# EAGLE schematic Power Supply Schematic v5 (EAGLE 9.7.0)
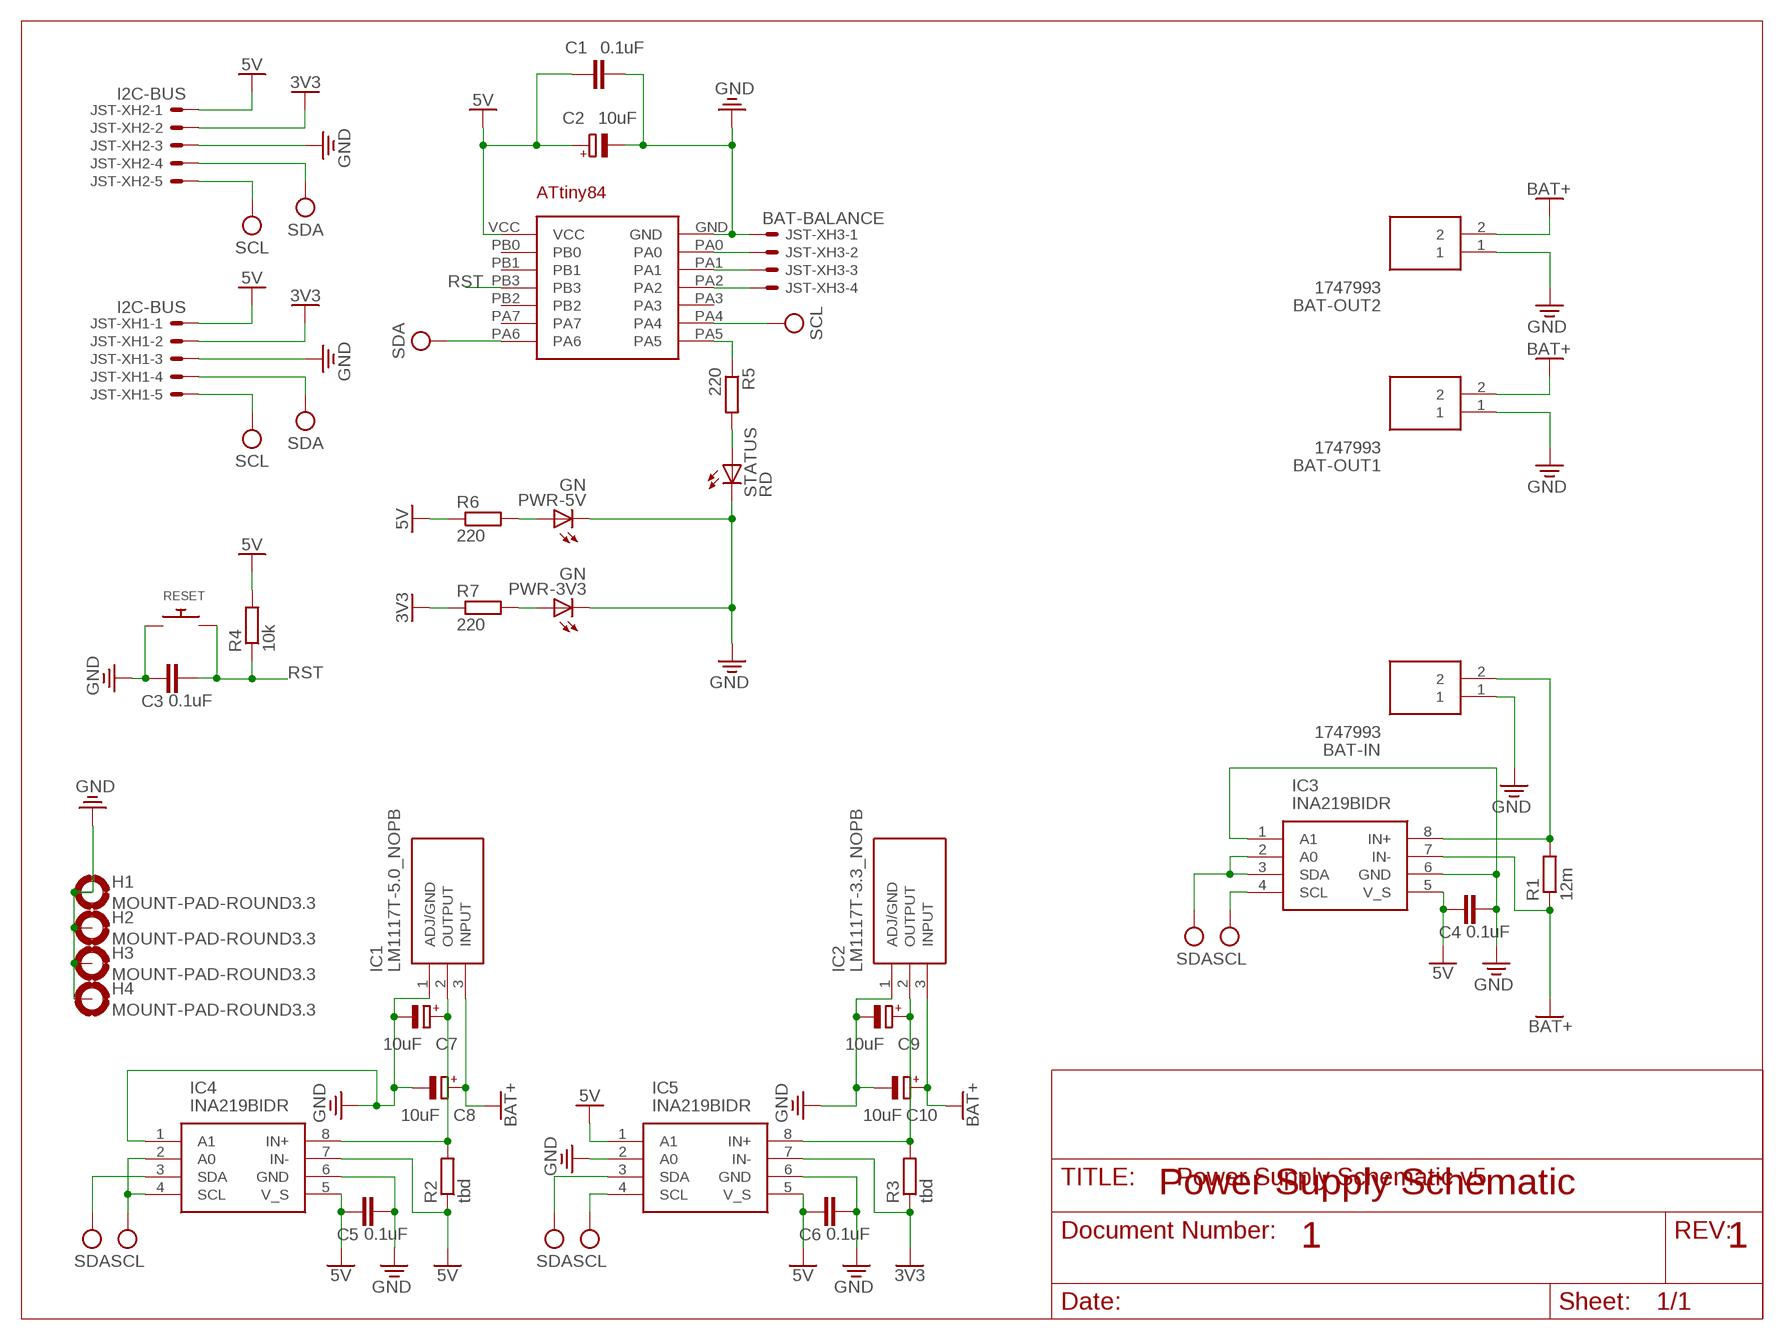
[diagram p0: schematic, sheet 1]

## Parts
BAT-IN  1747993  [1747993]
BAT-OUT1  1747993  [1747993]
BAT-OUT2  1747993  [1747993]
C1  0.1uF  C-EU025-025X050  [C025-025X050]
C2  10uF  CPOL-EUE5-10.5  [E5-10,5]
C3  0.1uF  C-EU025-030X050  [C025-030X050]
C4  0.1uF  C-EU025-030X050  [C025-030X050]
C5  0.1uF  C-EU025-030X050  [C025-030X050]
C6  0.1uF  C-EU025-030X050  [C025-030X050]
C7  10uF  CPOL-EUE5-10.5  [E5-10,5]
C8  10uF  CPOL-EUE5-10.5  [E5-10,5]
C9  10uF  CPOL-EUE5-10.5  [E5-10,5]
C10  10uF  CPOL-EUE5-10.5  [E5-10,5]
H1  MOUNT-PAD-ROUND3.3  [3,3-PAD]
H2  MOUNT-PAD-ROUND3.3  [3,3-PAD]
H3  MOUNT-PAD-ROUND3.3  [3,3-PAD]
H4  MOUNT-PAD-ROUND3.3  [3,3-PAD]
IC1  LM1117T-5.0_NOPB  [TO254P470X1028X1955-3P]
IC2  LM1117T-3.3_NOPB  [TO254P470X1028X1955-3P]
IC3  INA219BIDR  [SOIC127P600X175-8N]
IC4  INA219BIDR  [SOIC127P600X175-8N]
IC5  INA219BIDR  [SOIC127P600X175-8N]
JST-XH1  I2C-BUS  JST-XH-05-PIN-LONG-PAD  [JST-XH-05-PACKAGE-LONG-PAD]
JST-XH2  I2C-BUS  JST-XH-05-PIN-LONG-PAD  [JST-XH-05-PACKAGE-LONG-PAD]
JST-XH3  BAT-BALANCE  JST-XH-04-PIN-LONG-PAD  [JST-XH-04-PACKAGE-LONG-PAD]
PWR-3V3  GN  LED5MM  [LED5MM]
PWR-5V  GN  LED5MM  [LED5MM]
R1  12m  R-EU_0204/7  [0204/7]
R2  tbd  R-EU_0204/7  [0204/7]
R3  tbd  R-EU_0204/7  [0204/7]
R4  10k  R-EU_0204/7  [0204/7]
R5  220  R-EU_0204/7  [0204/7]
R6  220  R-EU_0204/7  [0204/7]
R7  220  R-EU_0204/7  [0204/7]
RESET  SWITCH_PUSHBUTTONEVQ-PE  [TACT_PANA-EVQ]
STATUS  RD  LED5MM  [LED5MM]
U$1  ATTINY84DIP  [ATTINY84(DIP)]

## Nets
3V3: IC5.7(IN-) JST-XH1.2 JST-XH2.2 R3.1 R7.1
5V: C1.1 C2.+ C4.1 C5.1 C6.1 IC3.5(V_S) IC4.5(V_S) IC4.7(IN-) IC5.1(A1) IC5.5(V_S) JST-XH1.1 JST-XH2.1 R2.1 R4.2 R6.1 U$1.VCC
BAT+: BAT-OUT1.2 BAT-OUT2.2 C8.+ C10.+ IC1.3(INPUT) IC2.3(INPUT) IC3.7(IN-) R1.1
GND: BAT-IN.1 BAT-OUT1.1 BAT-OUT2.1 C1.2 C2.- C3.1 C4.2 C5.2 C6.2 C7.- C8.- C9.- C10.- H1.B3,3(MOUNT) H2.B3,3(MOUNT) H3.B3,3(MOUNT) H4.B3,3(MOUNT) IC1.1(ADJ/GND) IC2.1(ADJ/GND) IC3.1(A1) IC3.6(GND) IC4.1(A1) IC4.6(GND) IC5.2(A0) IC5.6(GND) JST-XH1.3 JST-XH2.3 JST-XH3.1 PWR-3V3.K(C) PWR-5V.K(C) RESET.P$1 STATUS.K(C) U$1.GND
N$1: BAT-IN.2 IC3.8(IN+) R1.2
N$2: JST-XH3.2 U$1.PA0
N$3: JST-XH3.3 U$1.PA1
N$4: JST-XH3.4 U$1.PA2
N$5: C7.+ IC1.2(OUTPUT) IC4.8(IN+) R2.2
N$6: C9.+ IC2.2(OUTPUT) IC5.8(IN+) R3.2
N$7: R5.1 U$1.PA5
N$8: R5.2 STATUS.A
N$9: PWR-5V.A R6.2
N$10: PWR-3V3.A R7.2
RST: C3.2 R4.1 RESET.P$2 U$1.PB3
SCL: IC3.4(SCL) IC4.2(A0) IC4.4(SCL) IC5.4(SCL) JST-XH1.5 JST-XH2.5 U$1.PA4
SDA: IC3.2(A0) IC3.3(SDA) IC4.3(SDA) IC5.3(SDA) JST-XH1.4 JST-XH2.4 U$1.PA6
Unconnected: U$1.PA3 U$1.PA7 U$1.PB0 U$1.PB1 U$1.PB2

## Notes on the sheet
- Power Supply Schematic
- 1 | 1

## Library data of the parts
BAT-IN BAT-OUT1 BAT-OUT2 = SamacSys_Parts:1747993: PCB header, nominal cross section: 2.5 mm?, color: green, nominal current: 12 A, rated voltage (III/2): 320 V, contact surface: Gold, type of contact: Male connector, Number of potentials: 2, Number of rows: 1, Number of positions per row: 2, number of connections: 2, product range: MSTBVA 2,5/..-G, pitch: 5.08 mm, mounting: Wave soldering, pin layout: Linear pinning, solder pin [P]: 3.9 mm, Stecksystem: CLASSIC COMBICON, Locking: without, type of packaging: packed in cardboard Source: Datasheet <http://www.phoenixcontact.com/de/produkte/1747993/pdf>; DESCRIPTION: PCB header, nominal cross section: 2.5 mm?, color: green, nominal current: 12 A, rated voltage (III/2): 320 V, contact surface: Gold, type of contact: Male connector, Number of potentials: 2, Number of rows: 1, Number of positions per row: 2, number of connections: 2, product range: MSTBVA 2,5/..-G, pitch: 5.08 mm, mounting: Wave soldering, pin layout: Linear pinning, solder pin [P]: 3.9 mm, Stecksystem: CLASSIC COMBICON, Locking: without, type of packaging: packed in cardboard; HEIGHT: 12.15mm; MANUFACTURER_NAME: Phoenix Contact; MANUFACTURER_PART_NUMBER: 1747993; MOUSER_PART_NUMBER: 651-1747993; MOUSER_PRICE-STOCK: https://www.mouser.co.uk/ProductDetail/Phoenix-Contact/1747993?qs=cq3Rj917t3li0%2FrJTXaRgg%3D%3D
C1 C3-C6 = rcl:C-EU: CAPACITOR, European symbol; SPICEPREFIX: C
C2 C7-C10 = rcl:CPOL-EU: POLARIZED CAPACITOR, European symbol; SPICEPREFIX: C
H1-H4 = holes:MOUNT-PAD-ROUND: MOUNTING PAD, round
IC1 = SamacSys_Parts:LM1117T-5.0_NOPB: Space saving 800-mA low-dropout linear regulator with internal current limit Source: Datasheet <http://www.ti.com/lit/gpn/lm1117>; DESCRIPTION: Space saving 800-mA low-dropout linear regulator with internal current limit; HEIGHT: 4.7mm; MANUFACTURER_NAME: Texas Instruments; MANUFACTURER_PART_NUMBER: LM1117T-5.0/NOPB; MOUSER2_PART_NUMBER: 926-LM1117T-50/NOPB; MOUSER2_PRICE-STOCK: https://www.mouser.com/Search/Refine.aspx?Keyword=926-LM1117T-50%2FNOPB
IC2 = SamacSys_Parts:LM1117T-3.3_NOPB: 800mA,3.3V,LDO Voltage Reg.,LM1117T-3.3 Texas Instruments LM1117T-3.3/NOPB, LDO Voltage Regulator, 800mA, 3.3 V Source: Datasheet <http://www.ti.com/lit/ds/symlink/lm1117.pdf>; DESCRIPTION: 800mA,3.3V,LDO Voltage Reg.,LM1117T-3.3 Texas Instruments LM1117T-3.3/NOPB, LDO Voltage Regulator, 800mA, 3.3 V; HEIGHT: 4.7mm; MANUFACTURER_NAME: Texas Instruments; MANUFACTURER_PART_NUMBER: LM1117T-3.3/NOPB
IC3-IC5 = SamacSys_Parts:INA219BIDR: 26-V, Bidirectional, Zero-Drift, High-Side, I2C Out Current/Power Monitor Source: Datasheet <https://www.ti.com/lit/ds/symlink/ina219.pdf?HQS=TI-null-null-digikeymode-df-pf-null-wwe&ts=1601223553719>; DESCRIPTION: 26-V, Bidirectional, Zero-Drift, High-Side, I2C Out Current/Power Monitor; HEIGHT: 1.75mm; MANUFACTURER_NAME: Texas Instruments; MANUFACTURER_PART_NUMBER: INA219BIDR; MOUSER_PART_NUMBER: 595-INA219BIDR; MOUSER_PRICE-STOCK: https://www.mouser.co.uk/ProductDetail/Texas-Instruments/INA219BIDR?qs=1WmUhT%2FVMINyGsXNJcdD5Q%3D%3D
JST-XH1 JST-XH2 = Rembrandt Electronics - JST XH Connectors v1-0:JST-XH-05-PIN: JST XH Connector 2 Pin Wire to board connector. Pitch: 2,54 mm, (0.100") Number of pins: 5 Created by Rembrandt Electronics www.rembrandtelectronics.com
JST-XH3 = Rembrandt Electronics - JST XH Connectors v1-0:JST-XH-04-PIN: JST XH Connector 2 Pin Wire to board connector. Pitch: 2,54 mm, (0.100") Number of pins: 4 Created by Rembrandt Electronics www.rembrandtelectronics.com
PWR-3V3 PWR-5V STATUS = adafruit:LED: LED OSRAM: - CHIPLED LG R971, LG N971, LY N971, LG Q971, LY Q971, LO R971, LY R971 LH N974, LH R974 LS Q976, LO Q976, LY Q976 LO Q996 - Hyper CHIPLED LW Q18S LB Q993, LB Q99A, LB R99A - SideLED LS A670, LO A670, LY A670, LG A670, LP A670 LB A673, LV A673, LT A673, LW A673 LH A674 LY A675 LS A676, LA A676, LO A676, LY A676, LW A676 LS A679, LY A679, LG A679 - Hyper Micro SIDELED® LS Y876, LA Y876, LO Y876, LY Y876 LT Y87S - SmartLED LW L88C, LW L88S LB L89C, LB L89S, LG L890 LS L89K, LO L89K, LY L89K LS L896, LA L896, LO L896, LY L896 - TOPLED LS T670, LO T670, LY T670, LG T670, LP T670 LSG T670, LSP T670, LSY T670, LOP T670, LYG T670 LG T671, LOG T671, LSG T671 LB T673, LV T673, LT T673, LW T673 LH T674 LS T676, LA T676, LO T676, LY T676, LB T676, LH T676, LSB T676, LW T676 LB T67C, LV T67C, LT T67C, LS T67K, LO T67K, LY T67K, LW E67C LS E67B, LA E67B, LO E67B, LY E67B, LB E67C, LV E67C, LT E67C LW T67C LS T679, LY T679, LG T679 LS T770, LO T770, LY T770, LG T770, LP T770 LB T773, LV T773, LT T773, LW T773 LH T774 LS E675, LA E675, LY E675, LS T675 LS T776, LA T776, LO T776, LY T776, LB T776 LHGB T686 LT T68C, LB T68C - Hyper Mini TOPLED® LB M676 - Mini TOPLED Santana® LG M470 LS M47K, LO M47K, LY M47K Source: http://www.osram.convergy.de/
R1-R7 = rcl:R-EU_: RESISTOR, European symbol; SPICEPREFIX: R
RESET = adafruit:SWITCH_PUSHBUTTON: Buttons SOFTTOUCHSMD_SJ - Soft touch temporary push button (Super Junk Akihabara) Compatible with SKPMANE010 [Mouser: 688-SKPMAN] C&K_KSS = Digikey: KSS221GLFS
U$1 = RobotMower_Eagle_Library:ATTINY84